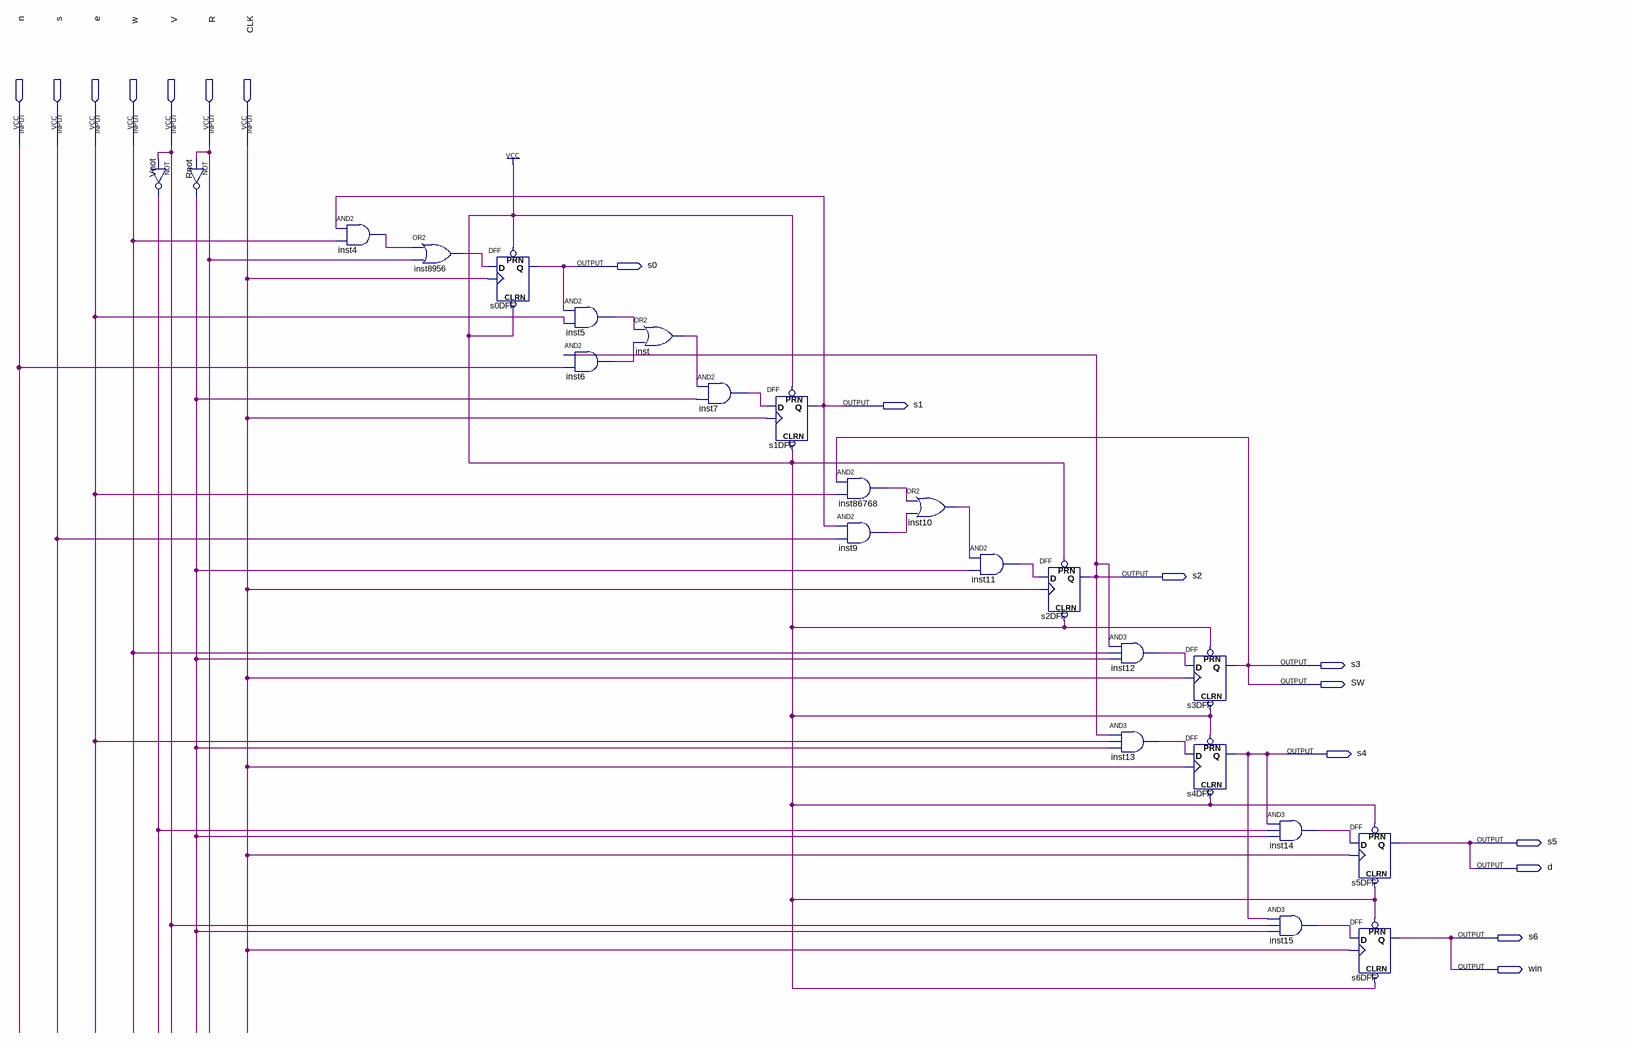
[diagram p0: schematic sheet]
// Quartus schematic room.bdf as structural Verilog: 23 symbols, 17 pins
module room (
  input  n,
  input  s,
  input  e,
  input  w,
  input  V,
  input  R,
  input  CLK,
  output s0,
  output s1,
  output s2,
  output s3,
  output SW,
  output s4,
  output s5,
  output d,
  output s6,
  output win
);

  wire inst4_out, inst5_out, inst6_out, inst7_out, inst9_out, inst10_out, inst11_out, inst12_out, inst13_out,
       inst14_out, inst15_out, inst8956_out, inst86768_out, inst_out, Rnot_out, Vnot_out;

  not Vnot (Vnot_out, V);
  not Rnot (Rnot_out, R);
  and inst4 (inst4_out, s1, w);
  or inst8956 (inst8956_out, inst4_out, R);
  DFF s0DFF (.CLRN(1'b1), .CLK(CLK), .D(inst8956_out), .PRN(1'b1), .Q(s0));
  and inst5 (inst5_out, s0, e);
  and inst6 (inst6_out, s2, n);
  or inst (inst_out, inst5_out, inst6_out);
  and inst7 (inst7_out, inst_out, Rnot_out);
  DFF s1DFF (.CLRN(1'b1), .CLK(CLK), .D(inst7_out), .PRN(1'b1), .Q(s1));
  and inst86768 (inst86768_out, s3, e);
  and inst9 (inst9_out, s1, s);
  or inst10 (inst10_out, inst86768_out, inst9_out);
  and inst11 (inst11_out, inst10_out, Rnot_out);
  DFF s2DFF (.CLRN(1'b1), .CLK(CLK), .D(inst11_out), .PRN(1'b1), .Q(s2));
  and inst12 (inst12_out, s2, w, Rnot_out);
  and inst13 (inst13_out, s2, e, Rnot_out);
  DFF s3DFF (.CLRN(1'b1), .CLK(CLK), .D(inst12_out), .PRN(1'b1), .Q(s3));
  DFF s4DFF (.CLRN(1'b1), .CLK(CLK), .D(inst13_out), .PRN(1'b1), .Q(s4));
  and inst14 (inst14_out, s4, Vnot_out, Rnot_out);
  and inst15 (inst15_out, s4, V, Rnot_out);
  DFF s5DFF (.CLRN(1'b1), .CLK(CLK), .D(inst14_out), .PRN(1'b1), .Q(d));
  DFF s6DFF (.CLRN(1'b1), .CLK(CLK), .D(inst15_out), .PRN(1'b1), .Q(s6));

  assign s5 = d;
  assign SW = s3;
  assign win = s6;
endmodule
